# EAGLE design brain1_v12 (EAGLE 9.5.2)

## Sheet 1 of 2
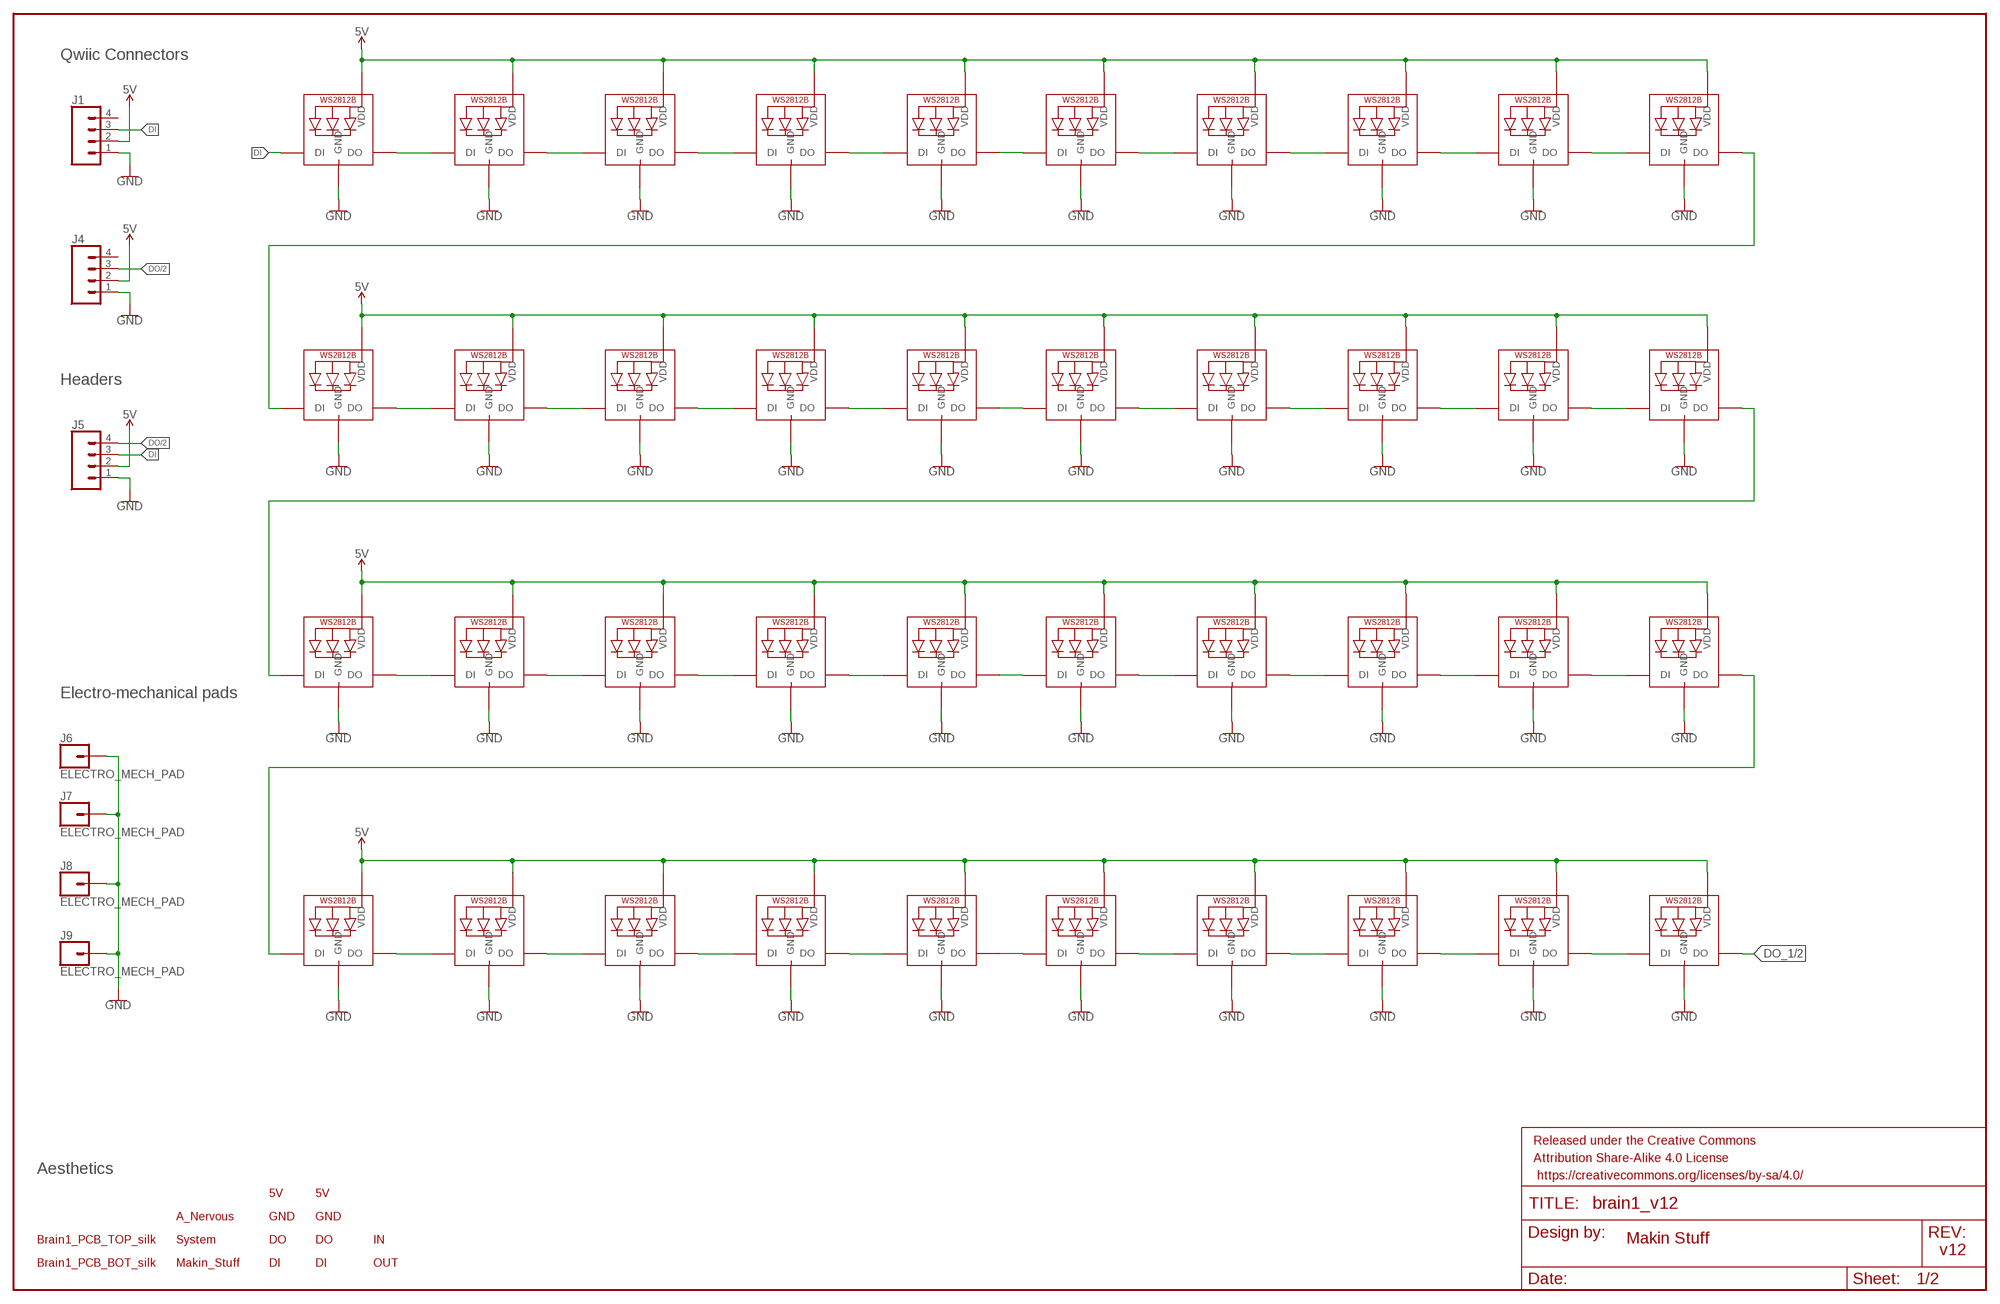
[diagram p0: schematic, sheet 1]

### Parts
FRAME2  FRAME-LEDGER  [CREATIVE_COMMONS]
J1  CONN_04SMD3  [JST04_1MM_RA]
J4  CONN_04SMD3  [JST04_1MM_RA]
J5  CONN_041X04_NO_SILK_NO_POP  [1X04_NO_SILK]
J6  ELECTRO_MECH_PAD  [5X3_SOLDER_PAD]
J7  ELECTRO_MECH_PAD  [5X3_SOLDER_PAD]
J8  ELECTRO_MECH_PAD  [5X3_SOLDER_PAD]
J9  ELECTRO_MECH_PAD  [5X3_SOLDER_PAD]
LED1  3.5X3.5_RGB_LED3.5X3.5  [3.5X3.5_RGB_LED]
LED2  3.5X3.5_RGB_LED3.5X3.5  [3.5X3.5_RGB_LED]
LED3  3.5X3.5_RGB_LED3.5X3.5  [3.5X3.5_RGB_LED]
LED4  3.5X3.5_RGB_LED3.5X3.5  [3.5X3.5_RGB_LED]
LED5  3.5X3.5_RGB_LED3.5X3.5  [3.5X3.5_RGB_LED]
LED6  3.5X3.5_RGB_LED3.5X3.5  [3.5X3.5_RGB_LED]
LED7  3.5X3.5_RGB_LED3.5X3.5  [3.5X3.5_RGB_LED]
LED8  3.5X3.5_RGB_LED3.5X3.5  [3.5X3.5_RGB_LED]
LED9  3.5X3.5_RGB_LED3.5X3.5  [3.5X3.5_RGB_LED]
LED10  3.5X3.5_RGB_LED3.5X3.5  [3.5X3.5_RGB_LED]
LED11  3.5X3.5_RGB_LED3.5X3.5  [3.5X3.5_RGB_LED]
LED12  3.5X3.5_RGB_LED3.5X3.5  [3.5X3.5_RGB_LED]
LED13  3.5X3.5_RGB_LED3.5X3.5  [3.5X3.5_RGB_LED]
LED14  3.5X3.5_RGB_LED3.5X3.5  [3.5X3.5_RGB_LED]
LED15  3.5X3.5_RGB_LED3.5X3.5  [3.5X3.5_RGB_LED]
LED16  3.5X3.5_RGB_LED3.5X3.5  [3.5X3.5_RGB_LED]
LED17  3.5X3.5_RGB_LED3.5X3.5  [3.5X3.5_RGB_LED]
LED18  3.5X3.5_RGB_LED3.5X3.5  [3.5X3.5_RGB_LED]
LED19  3.5X3.5_RGB_LED3.5X3.5  [3.5X3.5_RGB_LED]
LED20  3.5X3.5_RGB_LED3.5X3.5  [3.5X3.5_RGB_LED]
LED21  3.5X3.5_RGB_LED3.5X3.5  [3.5X3.5_RGB_LED]
LED22  3.5X3.5_RGB_LED3.5X3.5  [3.5X3.5_RGB_LED]
LED23  3.5X3.5_RGB_LED3.5X3.5  [3.5X3.5_RGB_LED]
LED24  3.5X3.5_RGB_LED3.5X3.5  [3.5X3.5_RGB_LED]
LED25  3.5X3.5_RGB_LED3.5X3.5  [3.5X3.5_RGB_LED]
LED26  3.5X3.5_RGB_LED3.5X3.5  [3.5X3.5_RGB_LED]
LED27  3.5X3.5_RGB_LED3.5X3.5  [3.5X3.5_RGB_LED]
LED28  3.5X3.5_RGB_LED3.5X3.5  [3.5X3.5_RGB_LED]
LED29  3.5X3.5_RGB_LED3.5X3.5  [3.5X3.5_RGB_LED]
LED30  3.5X3.5_RGB_LED3.5X3.5  [3.5X3.5_RGB_LED]
LED31  3.5X3.5_RGB_LED3.5X3.5  [3.5X3.5_RGB_LED]
LED32  3.5X3.5_RGB_LED3.5X3.5  [3.5X3.5_RGB_LED]
LED33  3.5X3.5_RGB_LED3.5X3.5  [3.5X3.5_RGB_LED]
LED34  3.5X3.5_RGB_LED3.5X3.5  [3.5X3.5_RGB_LED]
LED35  3.5X3.5_RGB_LED3.5X3.5  [3.5X3.5_RGB_LED]
LED36  3.5X3.5_RGB_LED3.5X3.5  [3.5X3.5_RGB_LED]
LED37  3.5X3.5_RGB_LED3.5X3.5  [3.5X3.5_RGB_LED]
LED38  3.5X3.5_RGB_LED3.5X3.5  [3.5X3.5_RGB_LED]
LED39  3.5X3.5_RGB_LED3.5X3.5  [3.5X3.5_RGB_LED]
LED40  3.5X3.5_RGB_LED3.5X3.5  [3.5X3.5_RGB_LED]
U$1  BRAIN1_PCB_BOT_SILK  [BRAIN1_PCB_BOT_SILK]
U$2  BRAIN1_PCB_TOP_SILK  [BRAIN1_PCB_TOP_SILK]
U$3  MAKIN_STUFF2  [MAKIN_STUFF2]
U$4  A_NERVOUS0  [A_NERVOUS0]
U$5  SYSTEM1  [SYSTEM1]
U$6  5V1  [5V1]
U$7  GND0  [GND0]
U$8  DO3  [DO3]
U$9  DI0  [DI0]
U$10  5V1  [5V1]
U$11  GND0  [GND0]
U$12  DI0  [DI0]
U$13  DO3  [DO3]
U$14  IN0  [IN0]
U$15  OUT1  [OUT1]

### Nets
5V: J1.2 J4.2 J5.2 LED1.4(VDD) LED2.4(VDD) LED3.4(VDD) LED4.4(VDD) LED5.4(VDD) LED6.4(VDD) LED7.4(VDD) LED8.4(VDD) LED9.4(VDD) LED10.4(VDD) LED11.4(VDD) LED12.4(VDD) LED13.4(VDD) LED14.4(VDD) LED15.4(VDD) LED16.4(VDD) LED17.4(VDD) LED18.4(VDD) LED19.4(VDD) LED20.4(VDD) LED21.4(VDD) LED22.4(VDD) LED23.4(VDD) LED24.4(VDD) LED25.4(VDD) LED26.4(VDD) LED27.4(VDD) LED28.4(VDD) LED29.4(VDD) LED30.4(VDD) LED31.4(VDD) LED32.4(VDD) LED33.4(VDD) LED34.4(VDD) LED35.4(VDD) LED36.4(VDD) LED37.4(VDD) LED38.4(VDD) LED39.4(VDD) LED40.4(VDD) ; also sheet 2
DI: J1.3 J5.3 LED1.3(DI)
DO: J4.3 J5.4 ; also sheet 2
DO_1: LED40.1(DO) ; also sheet 2
GND: J1.1 J4.1 J5.1 J6.P$1 J7.P$1 J8.P$1 J9.P$1 LED1.2(GND) LED2.2(GND) LED3.2(GND) LED4.2(GND) LED5.2(GND) LED6.2(GND) LED7.2(GND) LED8.2(GND) LED9.2(GND) LED10.2(GND) LED11.2(GND) LED12.2(GND) LED13.2(GND) LED14.2(GND) LED15.2(GND) LED16.2(GND) LED17.2(GND) LED18.2(GND) LED19.2(GND) LED20.2(GND) LED21.2(GND) LED22.2(GND) LED23.2(GND) LED24.2(GND) LED25.2(GND) LED26.2(GND) LED27.2(GND) LED28.2(GND) LED29.2(GND) LED30.2(GND) LED31.2(GND) LED32.2(GND) LED33.2(GND) LED34.2(GND) LED35.2(GND) LED36.2(GND) LED37.2(GND) LED38.2(GND) LED39.2(GND) LED40.2(GND) ; also sheet 2
N$1: LED1.1(DO) LED2.3(DI)
N$2: LED2.1(DO) LED3.3(DI)
N$3: LED3.1(DO) LED4.3(DI)
N$4: LED4.1(DO) LED5.3(DI)
N$5: LED6.1(DO) LED7.3(DI)
N$6: LED7.1(DO) LED8.3(DI)
N$7: LED8.1(DO) LED9.3(DI)
N$8: LED9.1(DO) LED10.3(DI)
N$9: LED11.1(DO) LED12.3(DI)
N$10: LED5.1(DO) LED6.3(DI)
N$11: LED12.1(DO) LED13.3(DI)
N$12: LED13.1(DO) LED14.3(DI)
N$13: LED14.1(DO) LED15.3(DI)
N$14: LED16.1(DO) LED17.3(DI)
N$15: LED17.1(DO) LED18.3(DI)
N$16: LED18.1(DO) LED19.3(DI)
N$17: LED19.1(DO) LED20.3(DI)
N$18: LED15.1(DO) LED16.3(DI)
N$19: LED21.1(DO) LED22.3(DI)
N$20: LED22.1(DO) LED23.3(DI)
N$21: LED23.1(DO) LED24.3(DI)
N$22: LED24.1(DO) LED25.3(DI)
N$23: LED26.1(DO) LED27.3(DI)
N$24: LED27.1(DO) LED28.3(DI)
N$25: LED28.1(DO) LED29.3(DI)
N$26: LED29.1(DO) LED30.3(DI)
N$27: LED25.1(DO) LED26.3(DI)
N$28: LED31.1(DO) LED32.3(DI)
N$29: LED32.1(DO) LED33.3(DI)
N$30: LED33.1(DO) LED34.3(DI)
N$31: LED34.1(DO) LED35.3(DI)
N$32: LED36.1(DO) LED37.3(DI)
N$33: LED37.1(DO) LED38.3(DI)
N$34: LED38.1(DO) LED39.3(DI)
N$35: LED39.1(DO) LED40.3(DI)
N$36: LED35.1(DO) LED36.3(DI)
N$37: LED10.1(DO) LED11.3(DI)
N$38: LED20.1(DO) LED21.3(DI)
N$39: LED30.1(DO) LED31.3(DI)
Unconnected: J1.4 J4.4

### Notes on the sheet
- Qwiic Connectors
- Headers
- Electro-mechanical pads
- Aesthetics
- Makin Stuff
- v12

## Sheet 2 of 2
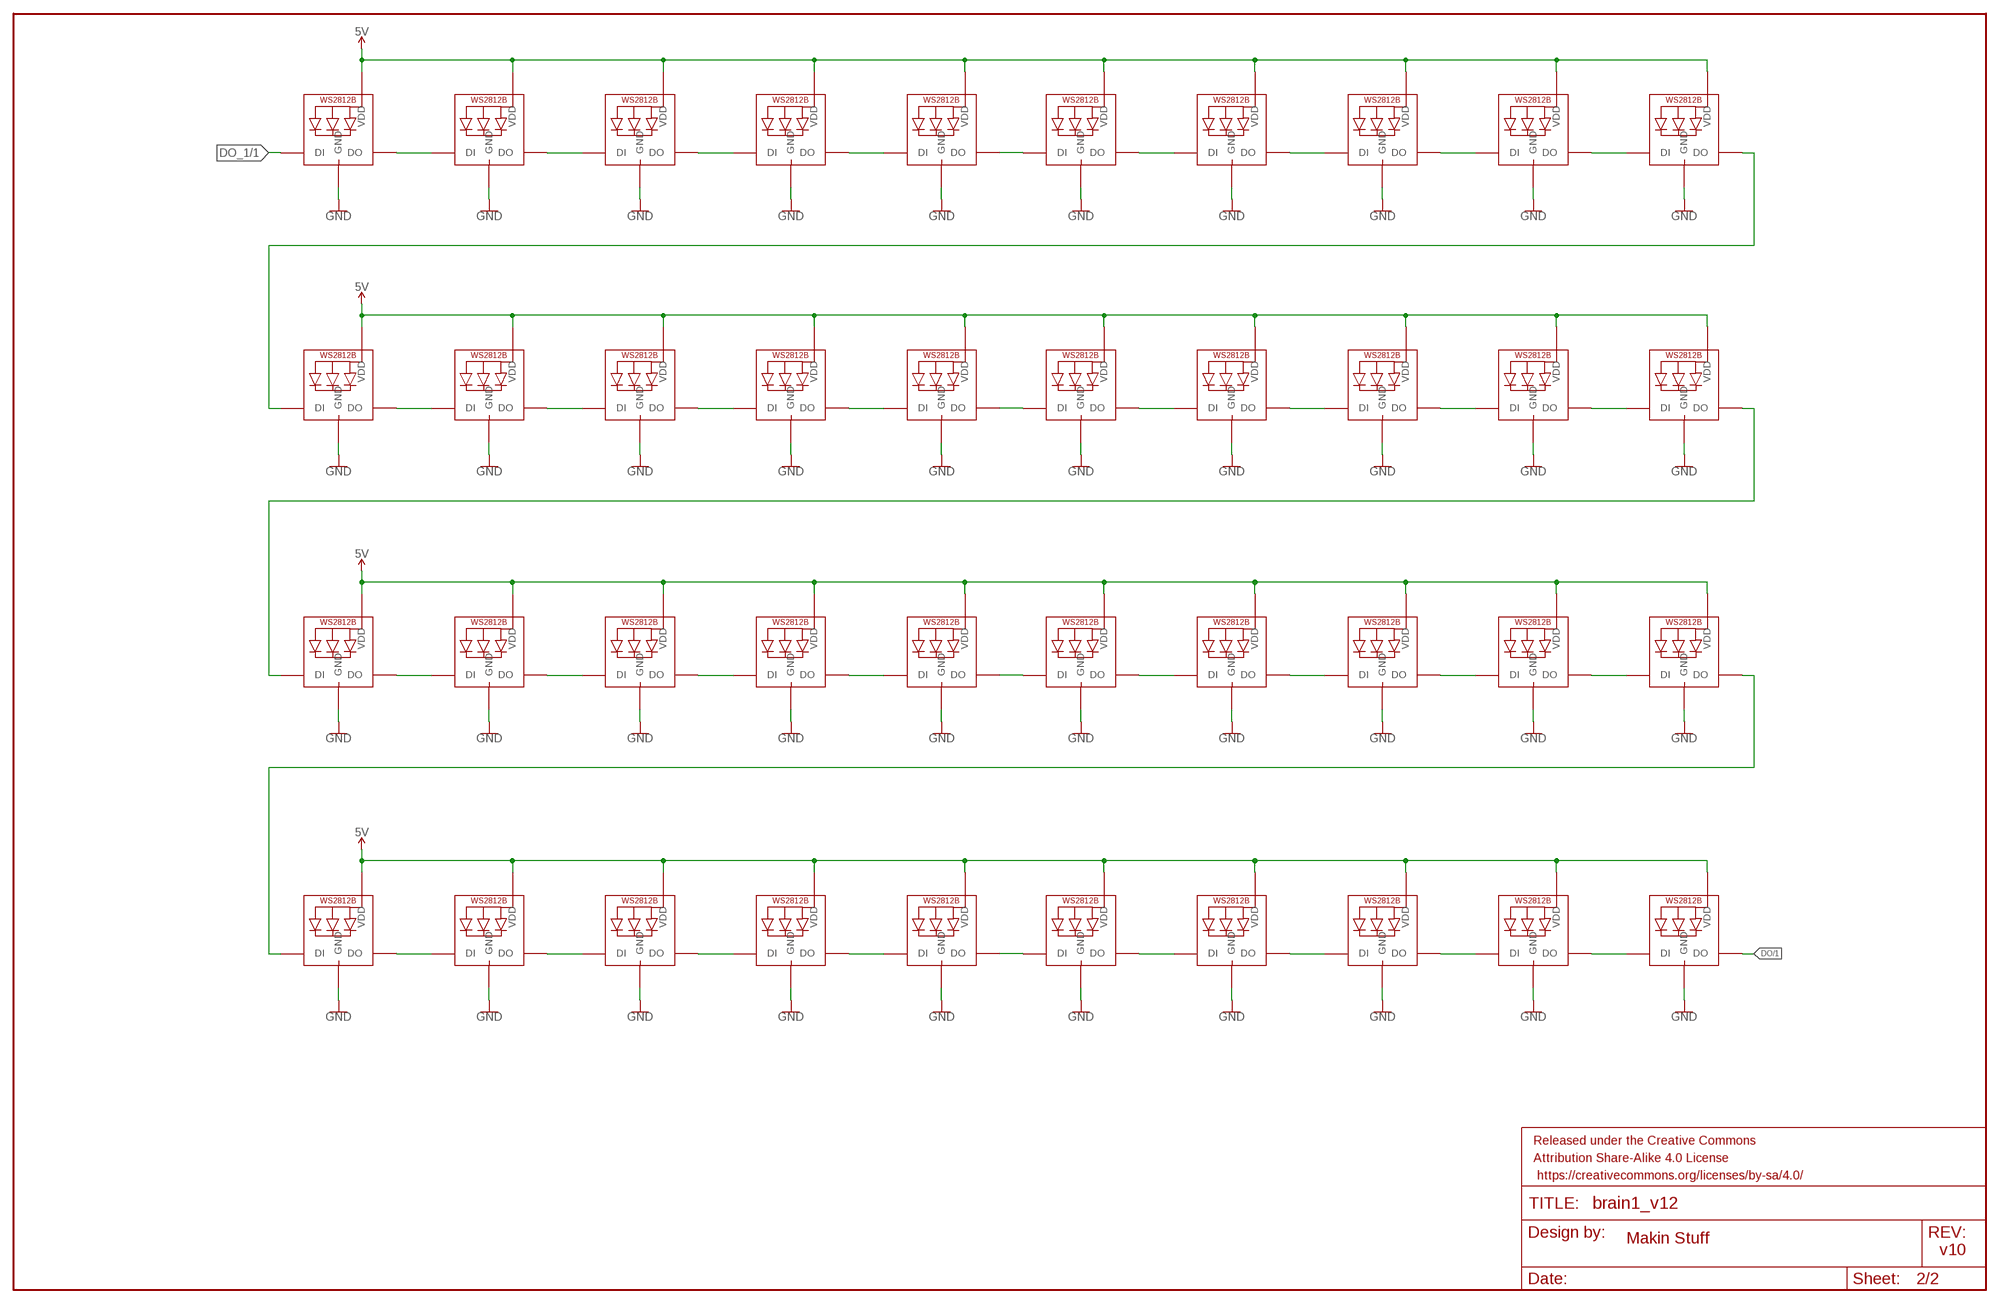
[diagram p1: schematic, sheet 2]

### Parts
FRAME1  FRAME-LEDGER  [CREATIVE_COMMONS]
FRAME3  FRAME-LEDGER  [CREATIVE_COMMONS]
LED41  3.5X3.5_RGB_LED3.5X3.5  [3.5X3.5_RGB_LED]
LED42  3.5X3.5_RGB_LED3.5X3.5  [3.5X3.5_RGB_LED]
LED43  3.5X3.5_RGB_LED3.5X3.5  [3.5X3.5_RGB_LED]
LED44  3.5X3.5_RGB_LED3.5X3.5  [3.5X3.5_RGB_LED]
LED45  3.5X3.5_RGB_LED3.5X3.5  [3.5X3.5_RGB_LED]
LED46  3.5X3.5_RGB_LED3.5X3.5  [3.5X3.5_RGB_LED]
LED47  3.5X3.5_RGB_LED3.5X3.5  [3.5X3.5_RGB_LED]
LED48  3.5X3.5_RGB_LED3.5X3.5  [3.5X3.5_RGB_LED]
LED49  3.5X3.5_RGB_LED3.5X3.5  [3.5X3.5_RGB_LED]
LED50  3.5X3.5_RGB_LED3.5X3.5  [3.5X3.5_RGB_LED]
LED51  3.5X3.5_RGB_LED3.5X3.5  [3.5X3.5_RGB_LED]
LED52  3.5X3.5_RGB_LED3.5X3.5  [3.5X3.5_RGB_LED]
LED53  3.5X3.5_RGB_LED3.5X3.5  [3.5X3.5_RGB_LED]
LED54  3.5X3.5_RGB_LED3.5X3.5  [3.5X3.5_RGB_LED]
LED55  3.5X3.5_RGB_LED3.5X3.5  [3.5X3.5_RGB_LED]
LED56  3.5X3.5_RGB_LED3.5X3.5  [3.5X3.5_RGB_LED]
LED57  3.5X3.5_RGB_LED3.5X3.5  [3.5X3.5_RGB_LED]
LED58  3.5X3.5_RGB_LED3.5X3.5  [3.5X3.5_RGB_LED]
LED59  3.5X3.5_RGB_LED3.5X3.5  [3.5X3.5_RGB_LED]
LED60  3.5X3.5_RGB_LED3.5X3.5  [3.5X3.5_RGB_LED]
LED61  3.5X3.5_RGB_LED3.5X3.5  [3.5X3.5_RGB_LED]
LED62  3.5X3.5_RGB_LED3.5X3.5  [3.5X3.5_RGB_LED]
LED63  3.5X3.5_RGB_LED3.5X3.5  [3.5X3.5_RGB_LED]
LED64  3.5X3.5_RGB_LED3.5X3.5  [3.5X3.5_RGB_LED]
LED65  3.5X3.5_RGB_LED3.5X3.5  [3.5X3.5_RGB_LED]
LED66  3.5X3.5_RGB_LED3.5X3.5  [3.5X3.5_RGB_LED]
LED67  3.5X3.5_RGB_LED3.5X3.5  [3.5X3.5_RGB_LED]
LED68  3.5X3.5_RGB_LED3.5X3.5  [3.5X3.5_RGB_LED]
LED69  3.5X3.5_RGB_LED3.5X3.5  [3.5X3.5_RGB_LED]
LED70  3.5X3.5_RGB_LED3.5X3.5  [3.5X3.5_RGB_LED]
LED71  3.5X3.5_RGB_LED3.5X3.5  [3.5X3.5_RGB_LED]
LED72  3.5X3.5_RGB_LED3.5X3.5  [3.5X3.5_RGB_LED]
LED73  3.5X3.5_RGB_LED3.5X3.5  [3.5X3.5_RGB_LED]
LED74  3.5X3.5_RGB_LED3.5X3.5  [3.5X3.5_RGB_LED]
LED75  3.5X3.5_RGB_LED3.5X3.5  [3.5X3.5_RGB_LED]
LED76  3.5X3.5_RGB_LED3.5X3.5  [3.5X3.5_RGB_LED]
LED77  3.5X3.5_RGB_LED3.5X3.5  [3.5X3.5_RGB_LED]
LED78  3.5X3.5_RGB_LED3.5X3.5  [3.5X3.5_RGB_LED]
LED79  3.5X3.5_RGB_LED3.5X3.5  [3.5X3.5_RGB_LED]
LED80  3.5X3.5_RGB_LED3.5X3.5  [3.5X3.5_RGB_LED]

### Nets
5V: LED41.4(VDD) LED42.4(VDD) LED43.4(VDD) LED44.4(VDD) LED45.4(VDD) LED46.4(VDD) LED47.4(VDD) LED48.4(VDD) LED49.4(VDD) LED50.4(VDD) LED51.4(VDD) LED52.4(VDD) LED53.4(VDD) LED54.4(VDD) LED55.4(VDD) LED56.4(VDD) LED57.4(VDD) LED58.4(VDD) LED59.4(VDD) LED60.4(VDD) LED61.4(VDD) LED62.4(VDD) LED63.4(VDD) LED64.4(VDD) LED65.4(VDD) LED66.4(VDD) LED67.4(VDD) LED68.4(VDD) LED69.4(VDD) LED70.4(VDD) LED71.4(VDD) LED72.4(VDD) LED73.4(VDD) LED74.4(VDD) LED75.4(VDD) LED76.4(VDD) LED77.4(VDD) LED78.4(VDD) LED79.4(VDD) LED80.4(VDD) ; also sheet 1
DO: LED80.1(DO) ; also sheet 1
DO_1: LED41.3(DI) ; also sheet 1
GND: LED41.2(GND) LED42.2(GND) LED43.2(GND) LED44.2(GND) LED45.2(GND) LED46.2(GND) LED47.2(GND) LED48.2(GND) LED49.2(GND) LED50.2(GND) LED51.2(GND) LED52.2(GND) LED53.2(GND) LED54.2(GND) LED55.2(GND) LED56.2(GND) LED57.2(GND) LED58.2(GND) LED59.2(GND) LED60.2(GND) LED61.2(GND) LED62.2(GND) LED63.2(GND) LED64.2(GND) LED65.2(GND) LED66.2(GND) LED67.2(GND) LED68.2(GND) LED69.2(GND) LED70.2(GND) LED71.2(GND) LED72.2(GND) LED73.2(GND) LED74.2(GND) LED75.2(GND) LED76.2(GND) LED77.2(GND) LED78.2(GND) LED79.2(GND) LED80.2(GND) ; also sheet 1
N$40: LED41.1(DO) LED42.3(DI)
N$41: LED42.1(DO) LED43.3(DI)
N$42: LED43.1(DO) LED44.3(DI)
N$43: LED44.1(DO) LED45.3(DI)
N$44: LED46.1(DO) LED47.3(DI)
N$45: LED47.1(DO) LED48.3(DI)
N$46: LED48.1(DO) LED49.3(DI)
N$47: LED49.1(DO) LED50.3(DI)
N$48: LED45.1(DO) LED46.3(DI)
N$49: LED51.1(DO) LED52.3(DI)
N$50: LED52.1(DO) LED53.3(DI)
N$51: LED53.1(DO) LED54.3(DI)
N$52: LED54.1(DO) LED55.3(DI)
N$53: LED56.1(DO) LED57.3(DI)
N$54: LED57.1(DO) LED58.3(DI)
N$55: LED58.1(DO) LED59.3(DI)
N$56: LED59.1(DO) LED60.3(DI)
N$57: LED55.1(DO) LED56.3(DI)
N$58: LED61.1(DO) LED62.3(DI)
N$59: LED62.1(DO) LED63.3(DI)
N$60: LED63.1(DO) LED64.3(DI)
N$61: LED64.1(DO) LED65.3(DI)
N$62: LED66.1(DO) LED67.3(DI)
N$63: LED67.1(DO) LED68.3(DI)
N$64: LED68.1(DO) LED69.3(DI)
N$65: LED69.1(DO) LED70.3(DI)
N$66: LED65.1(DO) LED66.3(DI)
N$67: LED71.1(DO) LED72.3(DI)
N$68: LED72.1(DO) LED73.3(DI)
N$69: LED73.1(DO) LED74.3(DI)
N$70: LED74.1(DO) LED75.3(DI)
N$71: LED76.1(DO) LED77.3(DI)
N$72: LED77.1(DO) LED78.3(DI)
N$73: LED78.1(DO) LED79.3(DI)
N$74: LED79.1(DO) LED80.3(DI)
N$75: LED75.1(DO) LED76.3(DI)
N$76: LED50.1(DO) LED51.3(DI)
N$77: LED60.1(DO) LED61.3(DI)
N$78: LED70.1(DO) LED71.3(DI)

### Notes on the sheet
- Makin Stuff
- v10

## Library data of the parts
FRAME1-FRAME3 = SparkFun-Aesthetics:FRAME-LEDGER: Schematic Frame - Ledger Standard 11x14 US Ledger frame
J1 J4 = SparkFun-Connectors:CONN_04: Multi connection point. Often used as Generic Header-pin footprint for 0.1 inch spaced/style header connections On any of the 0.1 inch spaced packages, you can populate with these: Break Away Headers - Straight (PRT-00116) Break Away Male Headers - Right Angle (PRT-00553) Female Headers (PRT-00115) Break Away Headers - Machine Pin (PRT-00117) Break Away Female Headers - Swiss Machine Pin (PRT-00743) For SCREWTERMINALS and SPRING TERMINALS visit here: Screw Terimnals on SparkFun.com (5mm/3.5mm/2.54mm spacing) This device is also useful as a general connection point to wire up your design to another part of your project. Our various solder wires solder well into these plated through hole pads. Hook-Up Wire - Assortment (Stranded, 22 AWG) (PRT-11375) Hook-Up Wire - Assortment (Solid Core, 22 AWG) (PRT-11367) View the entire wire category on our website here Special notes: Molex polarized connector foot print use with SKU : PRT-08231 with associated crimp pins and housings. 1MM SMD Version SKU: PRT-10208; COLOR: BLACK; PROD_ID: CONN-13694
J5 = SparkFun-Connectors:CONN_04: Multi connection point. Often used as Generic Header-pin footprint for 0.1 inch spaced/style header connections On any of the 0.1 inch spaced packages, you can populate with these: Break Away Headers - Straight (PRT-00116) Break Away Male Headers - Right Angle (PRT-00553) Female Headers (PRT-00115) Break Away Headers - Machine Pin (PRT-00117) Break Away Female Headers - Swiss Machine Pin (PRT-00743) For SCREWTERMINALS and SPRING TERMINALS visit here: Screw Terimnals on SparkFun.com (5mm/3.5mm/2.54mm spacing) This device is also useful as a general connection point to wire up your design to another part of your project. Our various solder wires solder well into these plated through hole pads. Hook-Up Wire - Assortment (Stranded, 22 AWG) (PRT-11375) Hook-Up Wire - Assortment (Solid Core, 22 AWG) (PRT-11367) View the entire wire category on our website here Special notes: Molex polarized connector foot print use with SKU : PRT-08231 with associated crimp pins and housings. 1MM SMD Version SKU: PRT-10208
J6-J9 = brain:ELECTRO_MECH_PAD
LED1-LED80 = brain:3.5X3.5_RGB_LED: This is a package for the 3.5x3.5MM Mini NeoPixel from Adafruit. The datasheet is here.
U$1 = brain:BRAIN1_PCB_BOT_SILK
U$2 = brain:BRAIN1_PCB_TOP_SILK
U$3 = buzzard_labels (5):MAKIN_STUFF2
U$4 = buzzard_labels (5):A_NERVOUS0
U$5 = buzzard_labels (5):SYSTEM1
U$6 = buzzard_labels (6):5V1
U$7 = buzzard_labels (6):GND0
U$8 = buzzard_labels (6):DO3
U$9 = buzzard_labels (7):DI0
U$10 = brain:5V1
U$11 = brain:GND0
U$12 = brain:DI0
U$13 = brain:DO3
U$14 = buzzard_labels (8):IN0
U$15 = buzzard_labels (8):OUT1

## Board
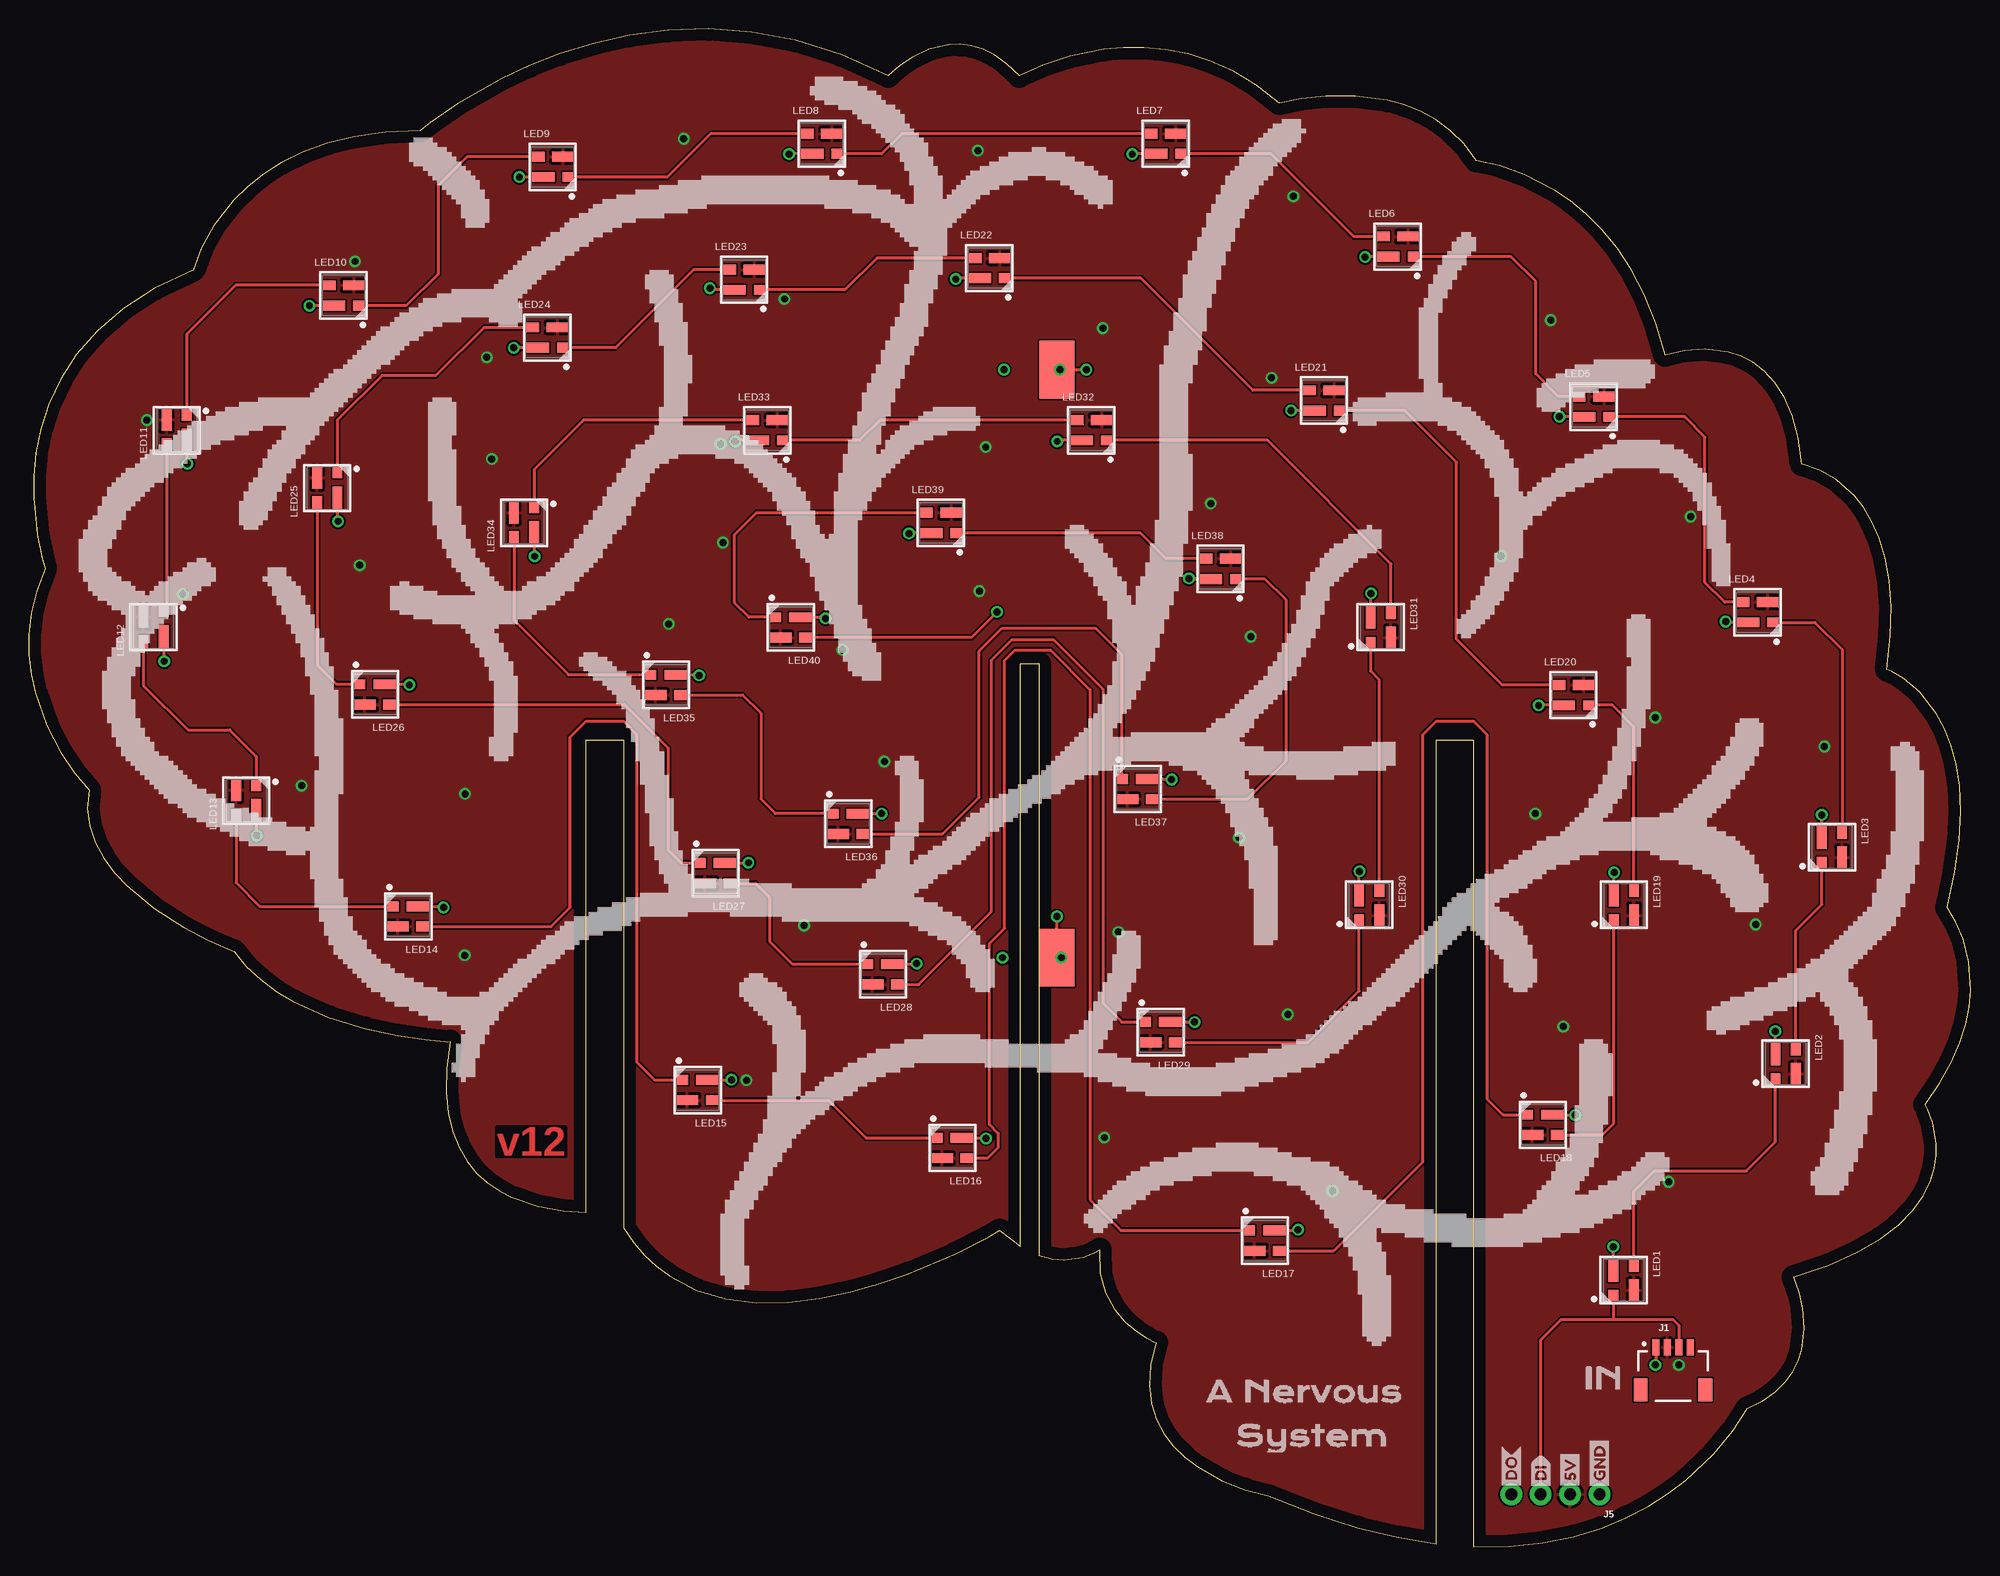
[diagram p2: board, top side]
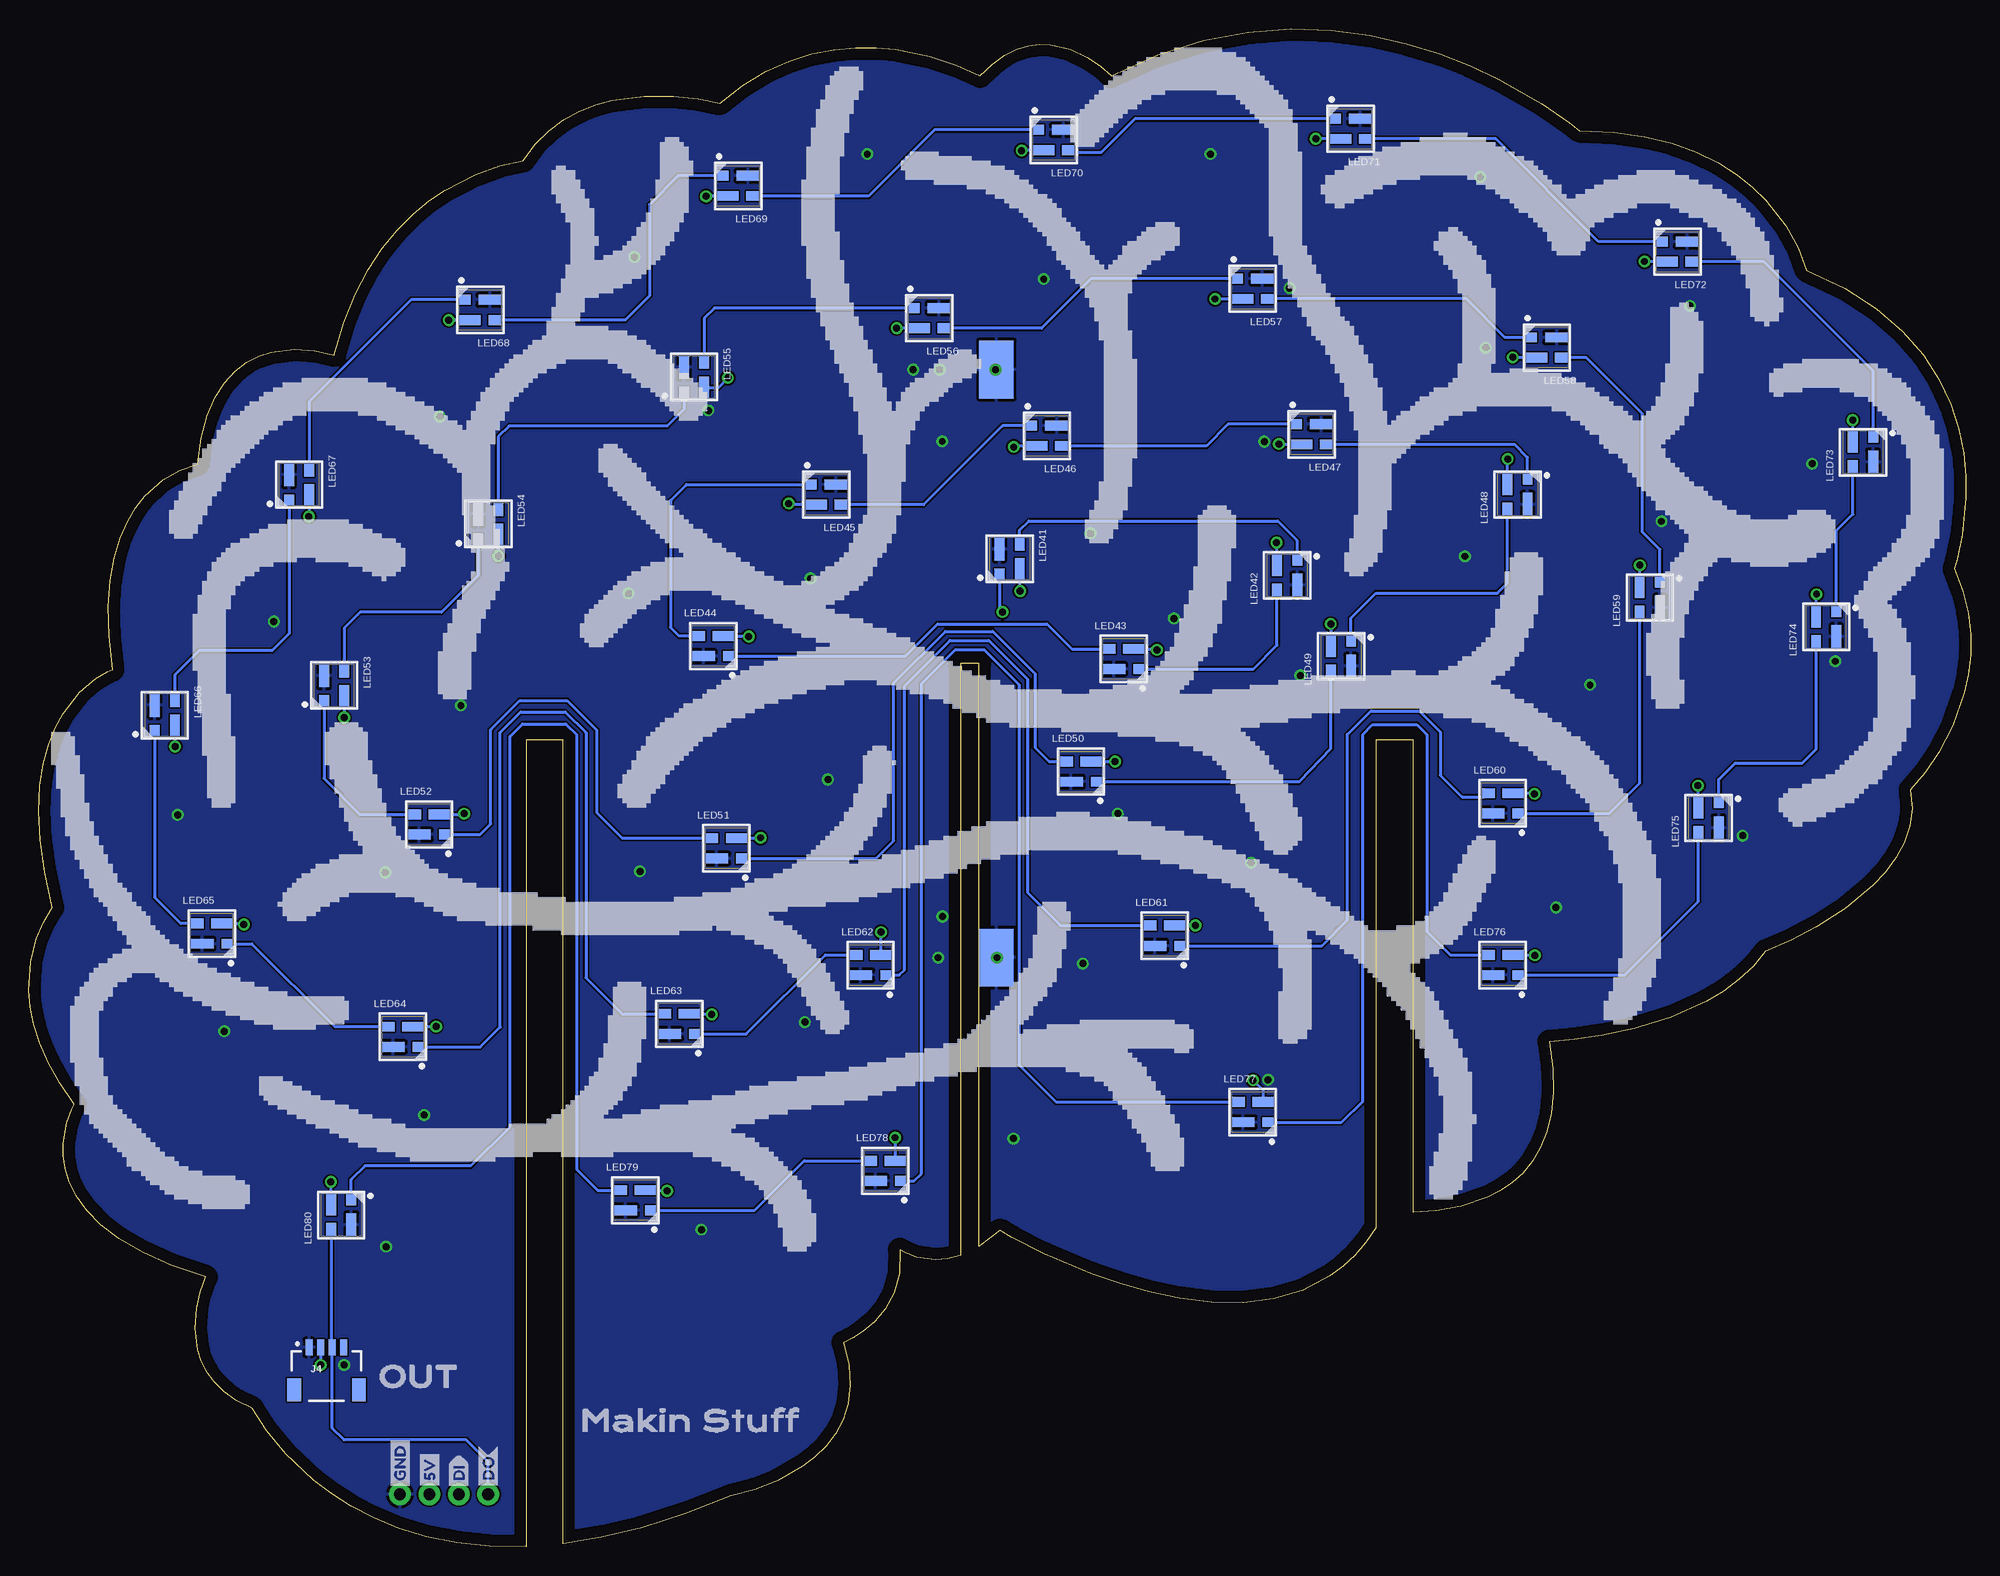
[diagram p3: board, bottom side, seen from below]

Size 167.71 x 131.1 mm. Coordinates in mm from the lower left corner, seen from the top.
Outline: 251 segments
Copper layers (1*16): Top 0.035mm / dielectric 1.5mm / Bottom 0.035mm
Design rules "default": minimum track width 6mil, minimum drill 0.35mm, track to track 6mil, track to pad 6mil, pad to pad 6mil, via to via 6mil, smd to smd 6mil, copper to edge 40mil, drill to drill 6mil, minimum pad ring 10mil, minimum via ring 8mil, stop-mask expansion 4mil, vias tented up to drill 0mil, thermal gap 10mil
tKeepout: area 48.1,69.6 to 51.4,130.5; area 121.7,69.6 to 124.9,130.5; area 85.6,76.3 to 87.4,129.7
bKeepout: area 121.6,69.7 to 124.8,124.3; area 85.6,76.3 to 87.2,130.4; area 48.1,69.7 to 51.4,131.8

### Footprints (pad centres in the part's own frame; a part is rotated, then mirrored left to right if it is on the bottom)
JST04_1MM_RA = smd 0.6 x 1.35: 1 -1.5,0; 2 -0.5,0; 3 0.5,0; 4 1.5,0 | smd 1.2 x 2: NC1 2.8,-3.675; NC2 -2.8,-3.675
1X04_NO_SILK = drill 1.016 pad 1.88: 1 0,0; 2 2.54,0; 3 5.08,0; 4 7.62,0
5X3_SOLDER_PAD = smd 5 x 3: P$1 0,0
3.5X3.5_RGB_LED = smd 1.15 x 0.85: 1 -1.275,0.875 | smd 2 x 0.85: 2 -0.85,-0.875 | smd 1 x 0.85: 3 1.35,-0.875 | smd 1.9 x 0.85: 4 0.9,0.875

### Placement (x,y rotation side)
FRAME1  155.98,-32.31 0 bottom  (outside the outline)
FRAME2  -80.23,-22.56 0 top  (outside the outline)
FRAME3  155.98,-41.2 0 bottom  (outside the outline)
J1  142.01,17.22 0 top
J4  142.01,17.22 0 bottom
J5  135.66,4.52 180 top
J6  88.79,50.88 90 top
J7  88.79,101.68 90 top
J8  84.14,50.88 270 bottom
J9  84.14,101.68 90 bottom
LED1  137.74,23.03 270 top
LED2  151.74,41.73 270 top
LED3  155.74,60.43 270 top
LED4  149.32,80.72 0 top
LED5  135.16,98.47 0 top
LED6  118.24,112.3 0 top
LED7  98.18,121.19 0 top
LED8  68.48,121.19 0 top
LED9  45.24,119.19 0 top
LED10  27.18,108.08 0 top
LED11  12.77,96.44 90 top
LED12  10.77,79.44 90 top
LED13  18.77,64.44 90 top
LED14  32.77,54.44 180 top
LED15  57.77,39.44 180 top
LED16  79.77,34.44 180 top
LED17  106.77,26.44 180 top
LED18  130.77,36.44 180 top
LED19  137.77,55.44 270 top
LED20  133.4,73.56 0 top
LED21  111.86,99.01 0 top
LED22  82.96,110.44 0 top
LED23  61.77,109.44 0 top
LED24  44.77,104.44 0 top
LED25  25.77,91.44 90 top
LED26  29.91,73.62 180 top
LED27  59.31,58.17 180 top
LED28  73.77,49.44 180 top
LED29  97.77,44.44 180 top
LED30  115.77,55.44 270 top
LED31  116.77,79.44 270 top
LED32  91.77,96.44 0 top
LED33  63.77,96.44 0 top
LED34  42.77,88.44 90 top
LED35  55.04,74.44 180 top
LED36  70.77,62.44 180 top
LED37  95.77,65.44 180 top
LED38  102.92,84.47 0 top
LED39  78.77,88.44 0 top
LED40  65.82,79.41 180 top
LED41  83,85.34 270 bottom
LED42  59.02,83.89 90 bottom
LED43  73.15,76.68 0 bottom
LED44  108.6,77.8 0 bottom
LED45  98.83,90.88 180 bottom
LED46  79.78,95.96 180 bottom
LED47  56.92,96.08 180 bottom
LED48  39.14,90.88 90 bottom
LED49  54.38,76.91 90 bottom
LED50  76.83,66.95 0 bottom
LED51  107.46,60.32 0 bottom
LED52  133.14,62.38 0 bottom
LED53  141.35,74.39 270 bottom
LED54  128.04,88.34 270 bottom
LED55  110.26,101.04 270 bottom
LED56  89.94,106.12 180 bottom
LED57  62,108.66 180 bottom
LED58  36.6,103.58 180 bottom
LED59  27.71,81.99 90 bottom
LED60  40.41,64.21 0 bottom
LED61  69.62,52.78 0 bottom
LED62  95.02,50.24 0 bottom
LED63  111.53,45.16 0 bottom
LED64  135.4,44.04 0 bottom
LED65  151.91,52.95 0 bottom
LED66  155.98,71.83 270 bottom
LED67  144.37,91.74 270 bottom
LED68  128.72,106.83 180 bottom
LED69  106.45,117.55 180 bottom
LED70  79.19,121.51 180 bottom
LED71  53.54,122.47 180 bottom
LED72  25.32,111.86 180 bottom
LED73  9.29,94.53 90 bottom
LED74  12.47,79.45 90 bottom
LED75  22.63,62.94 90 bottom
LED76  40.41,50.24 0 bottom
LED77  62,37.54 0 bottom
LED78  93.75,32.46 0 bottom
LED79  115.34,29.92 0 bottom
LED80  140.74,28.65 90 bottom
U$1  84.86,65.48 0 bottom
U$2  83.59,64.21 0 top
U$3  121.69,10.87 0 bottom
U$4  100.1,13.41 0 top
U$5  102.64,9.6 0 top
U$6  133.12,4.77 90 top
U$7  135.66,4.77 90 top
U$8  128.04,4.77 90 top
U$9  130.58,4.77 90 top
U$10  133.12,4.77 90 bottom
U$11  135.66,4.77 90 bottom
U$12  130.58,4.77 90 bottom
U$13  128.04,4.77 90 bottom
U$14  132.73,14.55 0 top
U$15  139.08,14.68 0 bottom

### Tracks (layer width: path | path; a pad name or v marks a point on that pad's centre or on a via)
5V  (via drill 0.6)
  Bottom 0.254: LED80.4 141.61,31.49 v141.63,31.51 | LED79.4 112.65,30.79 v112.59,30.73 | v92.88,35.33 92.85,35.29 LED78.4 | LED77.4 61.1,39.41 v61.97,40.28 | LED76.4 37.67,51.11 v37.64,51.07 | LED75.4 23.5,65.69 v23.54,65.73 | LED74.4 13.34,82.23 v13.3,82.27 | LED73.4 10.17,97.29 v10.18,97.3 | LED72.4 28.13,110.98 v28.16,111.02 | LED71.4 v56.55,121.6 v56.56,121.61 | LED70.4 81.92,120.63 v81.96,120.59 | LED69.4 108.86,116.67 108.89,116.64 v109.22,116.64 | LED68.4 131.43,105.95 v131.44,105.94 | LED67.4 143.49,89.01 v143.53,88.97 | LED66.4 155.1,69.12 v155.09,69.11 | LED65.4 149.23,53.83 v149.14,53.74 | LED64.4 132.55,44.91 v132.53,44.93 | LED63.4 108.79,46.03 v108.73,45.97 | LED62.4 v94.12,53.07 v94.1,53.08 | LED61.4 v66.95,53.65 v66.94,53.66 | LED60.4 37.72,65.08 v37.66,65.02 | LED59.4 28.58,84.77 v28.57,84.78 | LED58.4 39.51,102.7 v39.54,102.74 | LED57.4 v65.25,107.78 | LED56.4 92.74,105.24 v92.75,105.25 | LED55.4 108.16,100.14 v107.33,100.96 | LED54.4 127.16,85.58 v127.15,85.57 | LED53.4 140.47,71.63 v140.48,71.62 | LED52.4 130.18,63.25 v130.12,63.32 | LED51.4 104.55,61.2 v104.52,61.23 | LED50.4 v73.89,67.82 v73.88,67.81 | v55.26,79.7 55.25,79.69 LED49.4 | LED48.4 40.01,93.91 v39.97,93.95 | LED47.4 59.7,95.21 v59.73,95.25 | LED46.4 82.56,95.08 v82.65,94.99 | LED45.4 101.96,90 v102.08,90.11 | LED44.4 105.59,78.67 v105.53,78.61 | LED43.4 70.36,77.55 v70.28,77.47 | LED42.4 59.9,86.7 v59.94,86.74 | LED41.4 82.13,82.58 v82.09,82.55 | J4.2 v142.51,15.69
  pour Top: -0.23,-0.56 -0.23,131.52 168.68,131.52 168.68,-0.56
DI
  Top 0.254: LED1.3 136.86,19.63 | 136.86,19.63 142.01,19.63 142.51,19.13 J1.3 | J5.3 130.58,17.85 132.35,19.63 136.86,19.63
DO
  Bottom 0.254: LED80.1 141.61,17.32 J4.3 141.51,10.24 140.48,9.22 129.94,9.22 128.04,7.31 J5.4
DO_1  (via drill 0.6)
  Top 0.254: v83.61,80.74 81.4,78.53 LED40.1
  Bottom 0.254: LED41.3 83.88,81.01 v83.61,80.74
GND  (via drill 0.6)
  Top 0.254: LED1.2 136.86,25.89 v136.85,25.9 | LED2.2 150.86,44.51 v150.84,44.52 | LED3.2 v154.86,63.21 v154.86,63.22 | LED4.2 146.61,79.84 v146.55,79.9 | LED5.2 132.22,97.59 v132.2,97.61 | LED6.2 115.43,111.42 v115.41,111.4 | LED7.2 95.32,120.31 v95.29,120.29 | LED8.2 65.67,120.31 v65.65,120.29 | LED9.2 v42.36,118.31 | LED10.2 24.24,107.2 v24.23,107.18 | LED11.2 13.64,93.59 v13.68,93.54 | LED12.2 11.64,76.51 v11.68,76.47 | LED13.2 19.64,61.45 v19.68,61.41 | LED14.2 35.71,55.31 v35.81,55.21 | LED15.2 60.66,40.31 v60.67,40.33 | LED16.2 82.61,35.31 v82.67,35.25 | LED17.2 109.56,27.31 v109.62,27.38 | LED18.2 133.54,37.31 v133.57,37.28 | LED19.2 136.89,58.2 v136.93,58.24 | LED20.2 130.41,72.68 v130.4,72.66 | LED21.2 v109.02,98.13 v109.01,98.14 | LED22.2 80.12,109.56 v80.05,109.49 | LED23.2 58.97,108.56 v58.82,108.71 | LED24.2 41.89,103.56 v41.88,103.55 | LED25.2 26.64,88.61 v26.69,88.57 | LED26.2 32.81,74.49 v32.86,74.44 | LED27.2 62.11,59.04 v62.15,59.08 | LED28.2 76.62,50.31 v76.68,50.36 | LED29.2 v100.68,45.31 | LED30.2 114.89,58.3 v114.93,58.34 | LED31.2 115.89,82.31 v115.92,82.34 | LED38.2 100.24,83.59 v100.2,83.64 | LED32.2 88.91,95.56 v88.82,95.47 | LED33.2 61.12,95.56 v61,95.45 | LED34.2 43.64,85.58 v43.68,85.54 | LED35.2 57.82,75.31 v57.88,75.26 | LED36.2 v73.65,63.31 v73.65,63.32 | LED37.2 98.65,66.31 v98.7,66.26 | LED39.2 76.05,87.56 v76.02,87.52 | LED40.2 68.7,80.28 v68.8,80.18 | J1.1 140.51,15.72 v140.48,15.69 | J6.P$1 v88.79,54.43 | J7.P$1 v89.05,101.67 v91.33,101.67
  other vias: 89.17,50.87 84.09,50.87 84.22,101.67
  pour Bottom: -0.23,-0.56 -0.23,131.44 168.77,131.44 168.77,-0.56
N$1
  Top 0.254: LED1.1 138.61,30.69 140.38,32.46 148.36,32.46 150.86,34.96 LED2.3
N$2
  Top 0.254: LED2.1 152.61,53.22 154.86,55.47 LED3.3
N$3
  Top 0.254: LED4.3 154.26,79.84 156.61,77.49 LED3.1
N$4
  Top 0.254: LED4.1 146.46,81.59 144.77,83.28 144.77,95.83 143.01,97.59 LED5.3
N$5
  Top 0.254: LED6.1 114.43,113.17 107.29,120.31 LED7.3
N$6
  Top 0.254: LED7.1 75.4,122.06 73.65,120.31 LED8.3
N$7
  Top 0.254: LED8.1 58.89,122.06 55.14,118.31 LED9.3
N$8
  Top 0.254: LED9.1 37.84,120.06 35.33,117.55 35.33,109.93 32.6,107.2 LED10.3
N$9
  Top 0.254: LED11.1 11.89,81.04 LED12.3
N$10
  Top 0.254: LED5.1 132.12,99.34 130.14,101.32 130.14,109.29 128.01,111.42 LED6.3
N$11
  Top 0.254: LED12.1 9.89,74.4 13.74,70.56 17.34,70.56 19.64,68.26 LED13.3
N$12
  Top 0.254: LED13.1 17.89,57.36 19.94,55.31 LED14.3
N$13
  Top 0.254: LED14.1 45.1,53.56 46.76,55.21 46.76,69.93 48.13,71.3 51.34,71.3 52.5,70.14 52.5,41.85 54.05,40.31 LED15.3
N$14
  Top 0.254: LED17.3 94.32,27.31 91.67,29.96 91.67,74.01 88.25,77.43 85.15,77.43 84.27,76.55 84.27,53.41 82.95,52.08 82.95,36.46 83.71,35.7 83.71,34.45 82.82,33.56 LED16.1
N$15
  Top 0.254: LED17.1 112.71,25.56 120.4,33.25 120.4,70.14 121.56,71.3 124.78,71.3 125.94,70.14 125.94,38.69 127.32,37.31 LED18.3
N$16
  Top 0.254: LED18.1 135.89,35.56 136.89,36.56 LED19.3
N$17
  Top 0.254: LED19.1 138.64,70.82 136.78,72.68 LED20.3
N$18
  Top 0.254: LED15.1 69.07,38.56 72.32,35.31 LED16.3
N$19
  Top 0.254: LED21.1 105.72,99.88 96.04,109.56 LED22.3
N$20
  Top 0.254: LED22.1 73.24,111.31 70.49,108.56 LED23.3
N$21
  Top 0.254: LED23.1 57.43,110.31 50.68,103.56 LED24.3
N$22
  Top 0.254: LED24.1 39.3,105.31 35.15,101.16 30.5,101.16 26.64,97.3 LED25.3
N$23
  Top 0.254: LED26.1 51.43,72.74 55.19,68.98 55.19,60.19 56.34,59.04 LED27.3
N$24
  Top 0.254: LED28.3 65.93,50.31 63.98,52.26 63.98,56.07 62.76,57.29 LED27.1
N$25
  Top 0.254: LED28.1 76.84,48.56 83.13,54.85 83.13,76.57 84.91,78.35 88.49,78.35 92.76,74.08 92.76,46.96 94.4,45.31 LED29.3
N$26
  Top 0.254: LED29.1 110.46,43.56 114.89,47.99 LED30.3
N$27
  Top 0.254: LED26.3 26.54,74.49 24.89,76.14 LED25.1
N$28
  Top 0.254: LED31.1 117.64,84.89 106.97,95.56 LED32.3
N$29
  Top 0.254: LED32.1 73.51,97.31 71.76,95.56 LED33.3
N$30
  Top 0.254: LED33.1 47.91,97.31 43.64,93.04 LED34.3
N$31
  Top 0.254: LED34.1 41.89,80.02 46.6,75.31 LED35.3
N$32
  Top 0.254: LED36.1 78.9,61.56 82.06,64.73 82.06,77.34 84.06,79.34 92.11,79.34 94.36,77.09 94.36,66.31 LED37.3
N$33
  Top 0.254: LED37.1 105.25,64.56 108.56,67.87 108.56,81.79 106.75,83.59 LED38.3
N$34
  Top 0.254: LED38.1 98.21,85.34 95.99,87.56 LED39.3
N$35
  Top 0.254: LED39.1 62.84,89.31 60.91,87.38 60.91,81.55 62.18,80.28 LED40.3
N$36
  Top 0.254: LED36.3 64.49,63.31 63.22,64.58 63.22,71.99 61.64,73.56 LED35.1
N$37
  Top 0.254: LED10.1 17.84,108.95 13.64,104.75 LED11.3
N$38
  Top 0.254: LED21.3 118.85,98.13 123.31,93.67 123.31,78.38 127.26,74.43 LED20.1
N$39
  Top 0.254: LED30.1 116.64,74.86 115.89,75.61 LED31.3
N$40
  Bottom 0.254: LED42.3 58.15,86.92 59.84,88.6 81.35,88.6 82.13,87.83 LED41.1
N$41
  Bottom 0.254: LED43.3 61.96,75.8 59.9,77.86 LED42.1
N$42
  Bottom 0.254: LED44.3 92,76.92 89.22,79.7 79.78,79.7 77.63,77.55 LED43.1
N$43
  Bottom 0.254: LED45.3 110.9,91.75 112.29,90.36 112.29,79.41 111.56,78.67 LED44.1
N$44
  Bottom 0.254: LED47.3 64.13,96.96 66.01,95.08 LED46.1
N$45
  Bottom 0.254: LED47.1 39.38,95.21 38.26,94.09 LED48.3
N$46
  Bottom 0.254: LED49.3 53.5,80.22 51.35,82.37 40.86,82.37 40.01,83.22 LED48.1
N$47
  Bottom 0.254: LED50.3 75.46,66.06 58,66.06 55.25,68.96 LED49.1
N$48
  Bottom 0.254: LED46.3 83.6,96.83 90.43,90 LED45.1
N$49
  Bottom 0.254: LED52.3 128.74,61.5 127.82,62.43 127.82,70.58 125.32,73.08 121.22,73.08 118.67,70.53 118.67,63.4 116.46,61.2 LED51.1
N$50
  Bottom 0.254: LED53.3 142.22,66.35 139.12,63.25 LED52.1
N$51
  Bottom 0.254: LED54.3 128.91,83.88 132.07,80.72 139.11,80.72 140.47,79.36 LED53.1
N$52
  Bottom 0.254: LED55.3 111.13,98.24 112.58,96.79 126.24,96.79 127.16,95.87 LED54.1
N$53
  Bottom 0.254: LED57.3 64.23,109.53 64.24,109.52 75.96,109.52 80.24,105.24 LED56.1
N$54
  Bottom 0.254: LED58.3 40.21,104.45 43.54,107.78 LED57.1
N$55
  Bottom 0.254: LED59.3 26.83,86.13 28.34,87.63 28.34,97.86 33.18,102.7 LED58.1
N$56
  Bottom 0.254: LED60.3 31.2,63.33 28.58,65.95 LED59.1
N$57
  Bottom 0.254: LED56.3 108.49,106.99 109.38,106.1 LED55.1
N$58
  Bottom 0.254: LED62.3 92.55,49.36 92.1,49.81 92.1,74.33 88.16,78.27 84.78,78.27 81.46,74.94 81.46,56.49 78.62,53.65 LED61.1
N$59
  Bottom 0.254: LED63.3 105.75,44.28 98.92,51.11 LED62.1
N$60
  Bottom 0.254: LED64.3 128.72,43.16 127,44.88 127,70.33 125.23,72.11 121.39,72.11 119.59,70.31 119.59,49.13 116.49,46.03 LED63.1
N$61
  Bottom 0.254: LED65.3 148.45,52.08 141.29,44.91 LED64.1
N$62
  Bottom 0.254: LED67.3 145.24,78.85 146.7,77.39 153,77.39 155.1,75.29 LED66.1
N$63
  Bottom 0.254: LED68.3 134.68,107.7 143.49,98.89 LED67.1
N$64
  Bottom 0.254: LED69.3 111.62,118.42 114.12,115.92 114.12,108.05 116.21,105.95 LED68.1
N$65
  Bottom 0.254: LED70.3 89.49,122.38 95.2,116.67 LED69.1
N$66
  Bottom 0.254: LED66.3 156.85,56.09 154.59,53.83 LED65.1
N$67
  Bottom 0.254: LED72.3 32.14,112.73 41,121.6 LED71.1
N$68
  Bottom 0.254: LED73.3 8.42,101.56 17.84,110.98 LED72.1
N$69
  Bottom 0.254: LED74.3 11.59,87.76 10.17,89.19 LED73.1
N$70
  Bottom 0.254: LED75.3 21.75,66.27 20.35,67.66 14.56,67.66 13.34,68.88 LED74.1
N$71
  Bottom 0.254: LED77.3 54.32,36.66 52.5,38.48 52.5,70.14 51.65,70.99 47.82,70.99 46.97,70.14 46.97,53.14 44.94,51.11 LED76.1
N$72
  Bottom 0.254: LED78.3 91.26,31.58 90.62,32.22 90.62,74.54 87.69,77.48 85.21,77.48 82.19,74.47 82.19,41.63 78.97,38.41 LED77.1
N$73
  Bottom 0.254: LED79.3 105.03,29.04 100.74,33.33 LED78.1
N$74
  Bottom 0.254: LED80.3 139.86,31.71 138.67,32.89 129.54,32.89 126.17,36.27 126.17,69.99 125.08,71.07 121.33,71.07 120.4,70.14 120.4,32.59 118.6,30.79 LED79.1
N$75
  Bottom 0.254: LED76.3 29.88,49.36 23.5,55.74 LED75.1
N$76
  Bottom 0.254: LED51.3 94.54,59.45 93.01,60.97 93.01,74.6 88.56,79.06 84.44,79.06 80.79,75.41 80.79,69.02 79.6,67.82 LED50.1
N$77
  Bottom 0.254: LED61.3 56.04,51.9 53.83,54.11 53.83,70.15 51.79,72.19 47.6,72.19 45.8,70.38 45.8,66.63 43.94,64.77 42,64.77 LED60.1
N$78
  Bottom 0.254: LED71.3 72.17,123.35 75.1,120.42 77.92,120.42 LED70.1

### Text on the board
Top: v12